# EAGLE schematic first_board5 (EAGLE 7.2.0)

## Sheet 1 of 2: MAIN
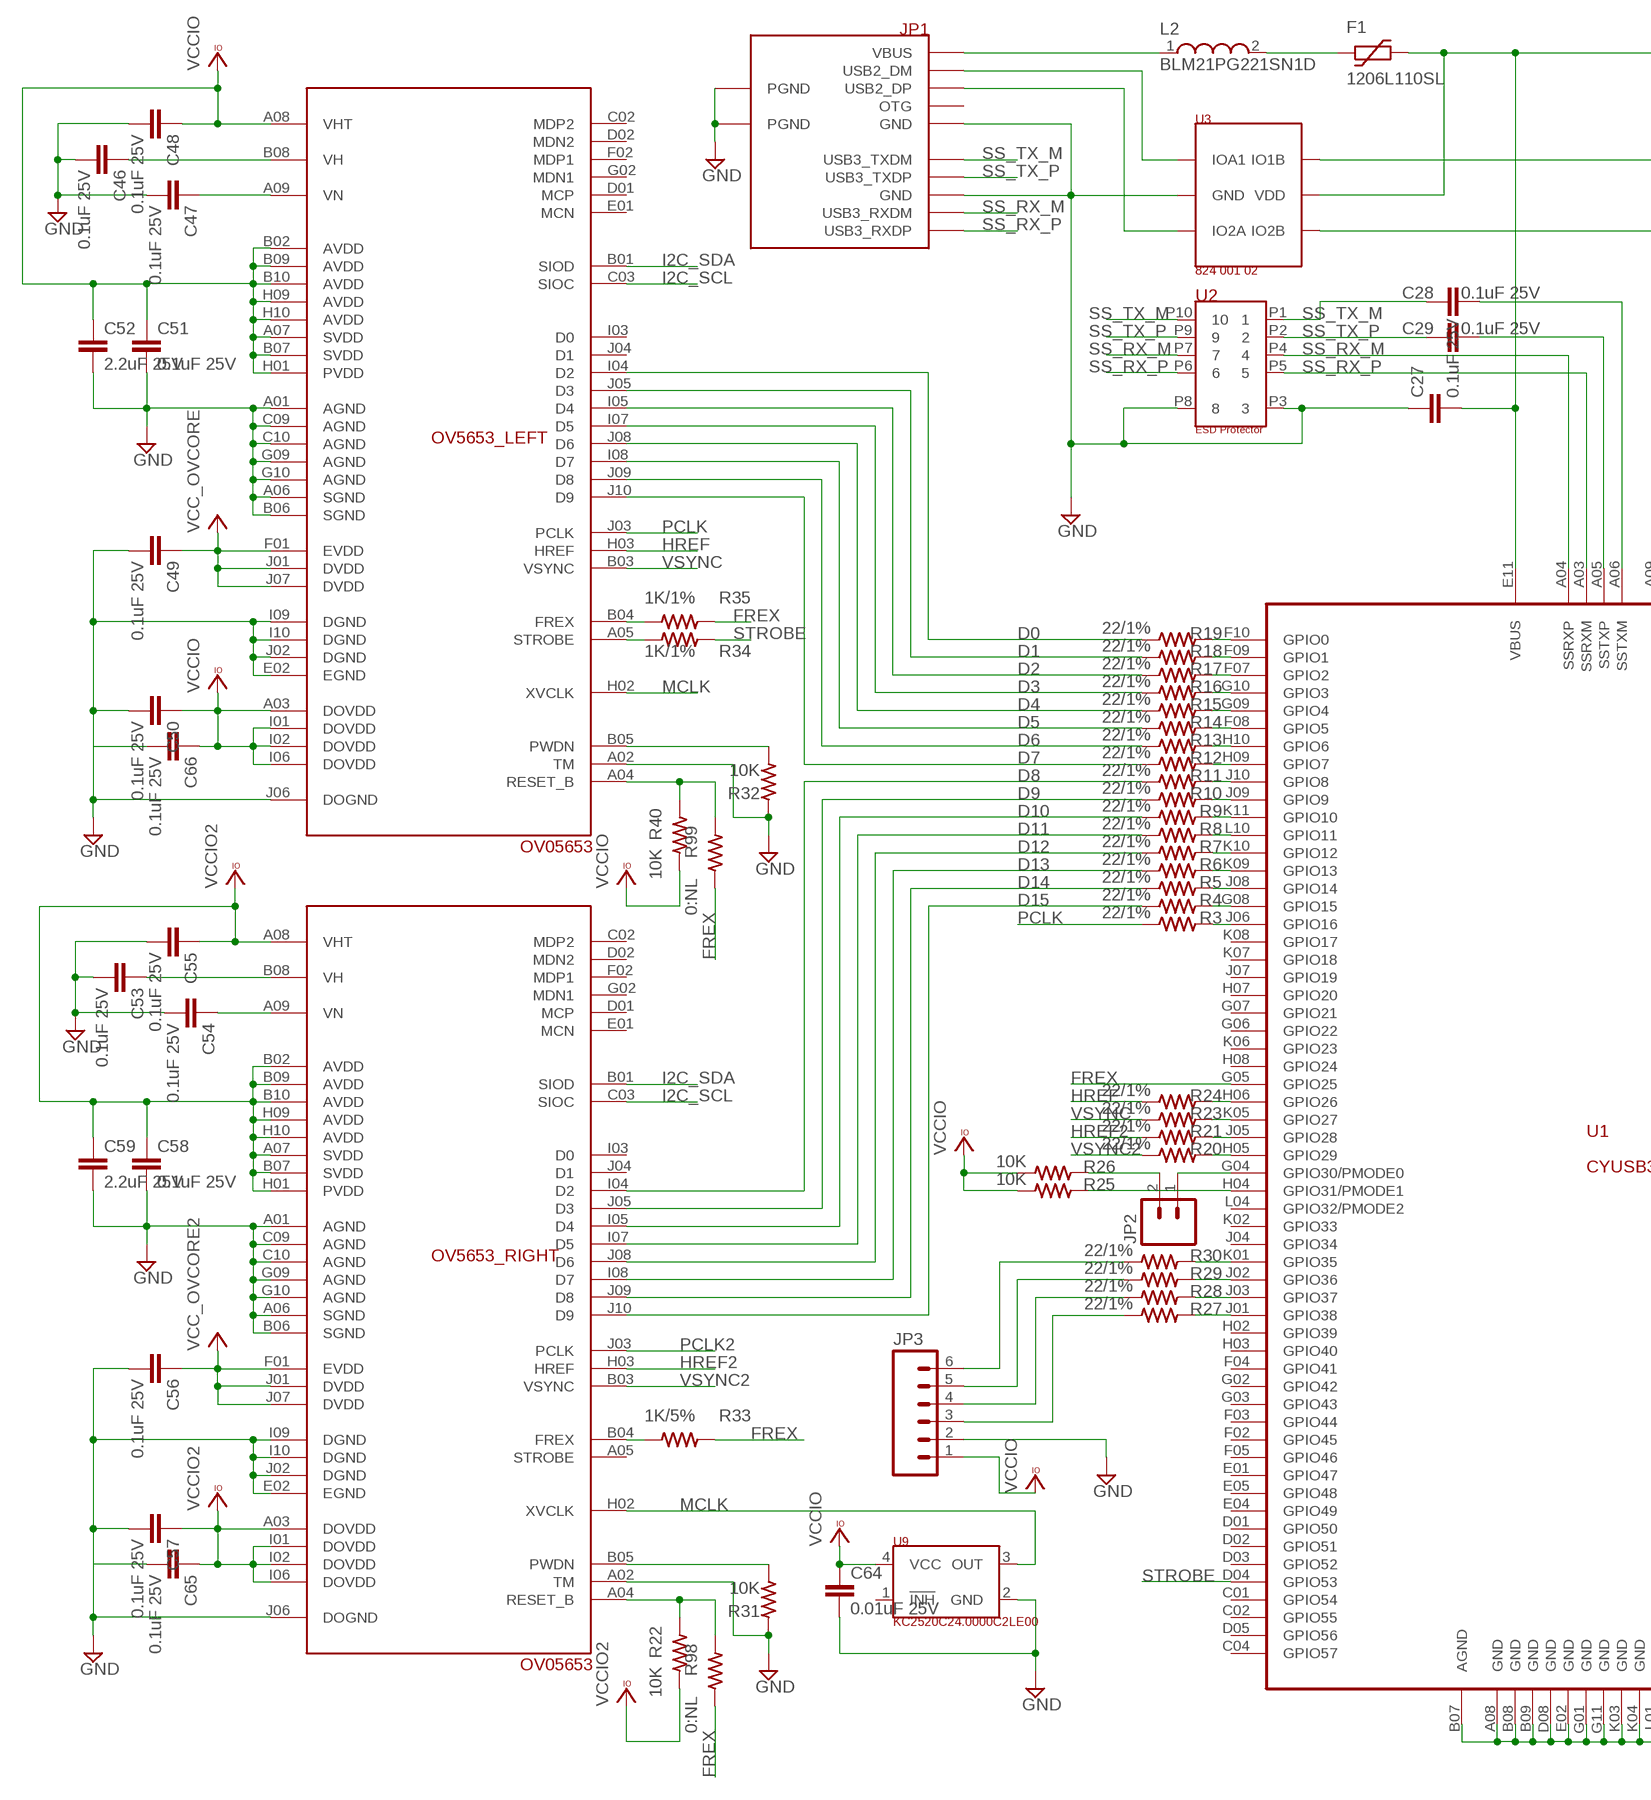
[diagram p0: schematic, sheet 1, part 1 of 2]
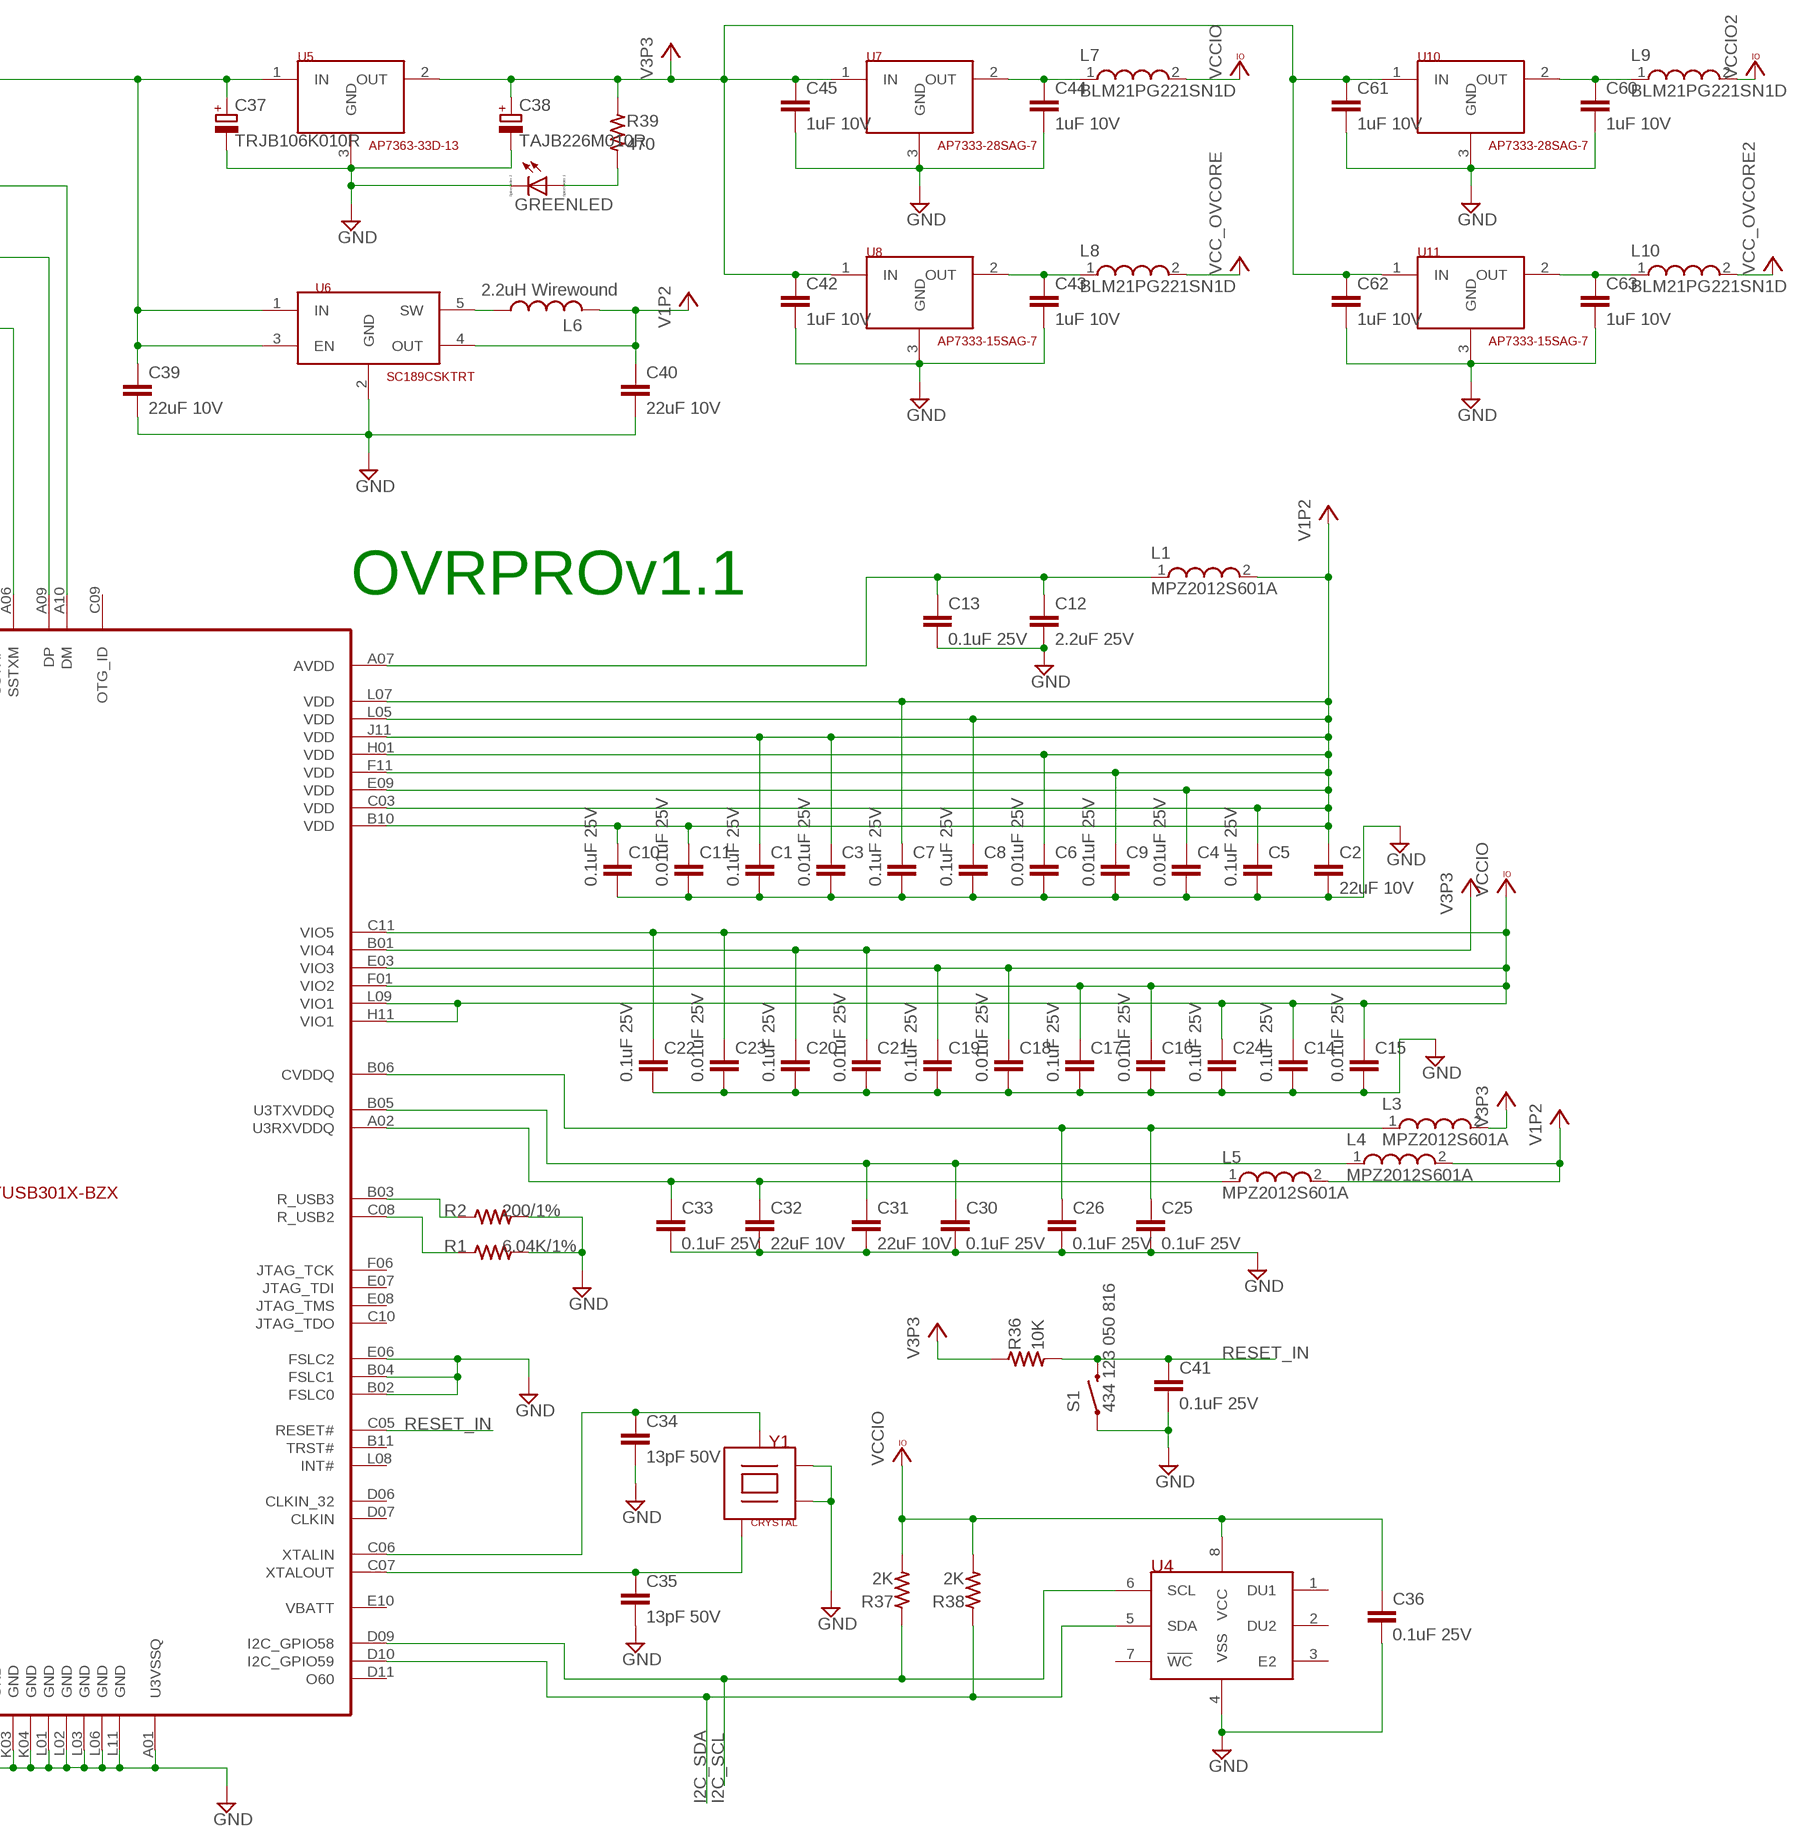
[diagram p1: schematic, sheet 1, part 2 of 2]

### Parts
C1  0.1uF 25V  C-EUC0402K  [C0402K]
C2  22uF 10V  C-EUC1206  [C1206]
C3  0.01uF 25V  C-EUC0402K  [C0402K]
C4  0.01uF 25V  C-EUC0402K  [C0402K]
C5  0.1uF 25V  C-EUC0402K  [C0402K]
C6  0.01uF 25V  C-EUC0402K  [C0402K]
C7  0.1uF 25V  C-EUC0402K  [C0402K]
C8  0.1uF 25V  C-EUC0402K  [C0402K]
C9  0.01uF 25V  C-EUC0402K  [C0402K]
C10  0.1uF 25V  C-EUC0402K  [C0402K]
C11  0.01uF 25V  C-EUC0402K  [C0402K]
C12  2.2uF 25V  C-EUC0805  [C0805]
C13  0.1uF 25V  C-EUC0402K  [C0402K]
C14  0.1uF 25V  C-EUC0402K  [C0402K]
C15  0.01uF 25V  C-EUC0402K  [C0402K]
C16  0.01uF 25V  C-EUC0402K  [C0402K]
C17  0.1uF 25V  C-EUC0402K  [C0402K]
C18  0.01uF 25V  C-EUC0402K  [C0402K]
C19  0.1uF 25V  C-EUC0402K  [C0402K]
C20  0.1uF 25V  C-EUC0402K  [C0402K]
C21  0.01uF 25V  C-EUC0402K  [C0402K]
C22  0.1uF 25V  C-EUC0402K  [C0402K]
C23  0.01uF 25V  C-EUC0402K  [C0402K]
C24  0.1uF 25V  C-EUC0402  [C0402]
C25  0.1uF 25V  C-EUC0402K  [C0402K]
C26  0.1uF 25V  C-EUC0402K  [C0402K]
C27  0.1uF 25V  C-EUC0402K  [C0402K]
C28  0.1uF 25V  C-EUC0402K  [C0402K]
C29  0.1uF 25V  C-EUC0402K  [C0402K]
C30  0.1uF 25V  C-EUC0402K  [C0402K]
C31  22uF 10V  C-EUC1206  [C1206]
C32  22uF 10V  C-EUC1206  [C1206]
C33  0.1uF 25V  C-EUC0402K  [C0402K]
C34  13pF 50V  C-EUC0402K  [C0402K]
C35  13pF 50V  C-EUC0402K  [C0402K]
C36  0.1uF 25V  C-EUC0402  [C0402]
C37  TRJB106K010R  CPOL-EUCT3528  [CT3528]
C38  TAJB226M010R  CPOL-EUCT3528  [CT3528]
C39  22uF 10V  C-EUC1206  [C1206]
C40  22uF 10V  C-EUC1206  [C1206]
C41  0.1uF 25V  C-EUC0402  [C0402]
C42  1uF 10V  C-EUC0402  [C0402]
C43  1uF 10V  C-EUC0402  [C0402]
C44  1uF 10V  C-EUC0402  [C0402]
C45  1uF 10V  C-EUC0402  [C0402]
C46  0.1uF 25V  C-EUC0402K  [C0402K]
C47  0.1uF 25V  C-EUC0402K  [C0402K]
C48  0.1uF 25V  C-EUC0402K  [C0402K]
C49  0.1uF 25V  C-EUC0402K  [C0402K]
C50  0.1uF 25V  C-EUC0402K  [C0402K]
C51  0.1uF 25V  C-EUC0402K  [C0402K]
C52  2.2uF 25V  C-EUC0805  [C0805]
C53  0.1uF 25V  C-EUC0402K  [C0402K]
C54  0.1uF 25V  C-EUC0402K  [C0402K]
C55  0.1uF 25V  C-EUC0402K  [C0402K]
C56  0.1uF 25V  C-EUC0402K  [C0402K]
C57  0.1uF 25V  C-EUC0402K  [C0402K]
C58  0.1uF 25V  C-EUC0402K  [C0402K]
C59  2.2uF 25V  C-EUC0805  [C0805]
C60  1uF 10V  C-EUC0402  [C0402]
C61  1uF 10V  C-EUC0402  [C0402]
C62  1uF 10V  C-EUC0402  [C0402]
C63  1uF 10V  C-EUC0402  [C0402]
C64  0.01uF 25V  C-EUC0402K  [C0402K]
C65  0.1uF 25V  C-EUC0402K  [C0402K]
C66  0.1uF 25V  C-EUC0402K  [C0402K]
F1  1206L110SL  1206L  [1206L]
GREENLED  LED_ESML0603  [LED_SML0603]
JP1  ZX360D-B-10PUSB3  [ZX360D-B-10PUSB3]
JP2  M02PTH  [1X02]
JP3  M06SILK_FEMALE_PTH  [1X06]
L1  MPZ2012S601A  WE-CBA_0805(WB/HS)  [WE-CBA_0805(W=3)]
L2  BLM21PG221SN1D  WE-CBA_0805(WB/HS)  [WE-CBA_0805(W=3)]
L3  MPZ2012S601A  WE-CBA_0805(WB/HS)  [WE-CBA_0805(W=3)]
L4  MPZ2012S601A  WE-CBA_0805(WB/HS)  [WE-CBA_0805(W=3)]
L5  MPZ2012S601A  WE-CBA_0805(WB/HS)  [WE-CBA_0805(W=3)]
L6  2.2uH Wirewound  L-USL3225M  [L3225M]
L7  BLM21PG221SN1D  WE-CBA_0805(WB/HS)  [WE-CBA_0805(W=3)]
L8  BLM21PG221SN1D  WE-CBA_0805(WB/HS)  [WE-CBA_0805(W=3)]
L9  BLM21PG221SN1D  WE-CBA_0805(WB/HS)  [WE-CBA_0805(W=3)]
L10  BLM21PG221SN1D  WE-CBA_0805(WB/HS)  [WE-CBA_0805(W=3)]
OV5653_LEFT  OV05653-A66A  [OV05653-A66A]
OV5653_RIGHT  OV05653-A66A  [OV05653-A66A]
R1  6.04K/1%  RESISTOR-US1608  [SMD1608]
R2  200/1%  RESISTOR-US1608  [SMD1608]
R3  22/1%  RESISTOR-US1005  [SMD1005]
R4  22/1%  RESISTOR-US1005  [SMD1005]
R5  22/1%  RESISTOR-US1005  [SMD1005]
R6  22/1%  RESISTOR-US1005  [SMD1005]
R7  22/1%  RESISTOR-US1005  [SMD1005]
R8  22/1%  RESISTOR-US1005  [SMD1005]
R9  22/1%  RESISTOR-US1005  [SMD1005]
R10  22/1%  RESISTOR-US1005  [SMD1005]
R11  22/1%  RESISTOR-US1005  [SMD1005]
R12  22/1%  RESISTOR-US1005  [SMD1005]
R13  22/1%  RESISTOR-US1005  [SMD1005]
R14  22/1%  RESISTOR-US1005  [SMD1005]
R15  22/1%  RESISTOR-US1005  [SMD1005]
R16  22/1%  RESISTOR-US1005  [SMD1005]
R17  22/1%  RESISTOR-US1005  [SMD1005]
R18  22/1%  RESISTOR-US1005  [SMD1005]
R19  22/1%  RESISTOR-US1005  [SMD1005]
R20  22/1%  RESISTOR-US1005  [SMD1005]
R21  22/1%  RESISTOR-US1005  [SMD1005]
R22  10K  RESISTOR-US1608  [SMD1608]
R23  22/1%  RESISTOR-US1005  [SMD1005]
R24  22/1%  RESISTOR-US1005  [SMD1005]
R25  10K  RESISTOR-US1608  [SMD1608]
R26  10K  RESISTOR-US1608  [SMD1608]
R27  22/1%  RESISTOR-US1005  [SMD1005]
R28  22/1%  RESISTOR-US1005  [SMD1005]
R29  22/1%  RESISTOR-US1005  [SMD1005]
R30  22/1%  RESISTOR-US1005  [SMD1005]
R31  10K  RESISTOR-US1608  [SMD1608]
R32  10K  RESISTOR-US1608  [SMD1608]
R33  1K/5%  RESISTOR-US1005  [SMD1005]
R34  1K/1%  RESISTOR-US1005  [SMD1005]
R35  1K/1%  RESISTOR-US1005  [SMD1005]
R36  10K  RESISTOR-US1608  [SMD1608]
R37  2K  RESISTOR-US1608  [SMD1608]
R38  2K  RESISTOR-US1608  [SMD1608]
R39  470  RESISTOR-US1608  [SMD1608]
R40  10K  RESISTOR-US1608  [SMD1608]
R98  0:NL  RESISTOR-US1005  [SMD1005]
R99  0:NL  RESISTOR-US1005  [SMD1005]
S1  434 123 050 816  SWITCH-MOMENTARY-2SMD-1101NE  [TACTILE-SWITCH-1101NE]
U1  CYUSB301X-BZX  [BGA121]
U2  SP3010-04UTG  [SP3010-04UTG]
U3  WE-82400102  [WE-82400102]
U4  M24M02-DRMN6TP  [SO-08]
U5  AP7363-33D-13  AP7363-XXD-13  [TO-252]
U6  SC189CSKTRT  PAM2305AABXXX  [SOT23-5]
U7  AP7333-28SAG-7  AP7333-XXSAG-7  [SOT23]
U8  AP7333-15SAG-7  AP7333-XXSAG-7  [SOT23]
U9  KC2520C24.0000C2LE00  KC2520C-C2  [KC2520C-C2]
U10  AP7333-28SAG-7  AP7333-XXSAG-7  [SOT23]
U11  AP7333-15SAG-7  AP7333-XXSAG-7  [SOT23]
Y1  NX2520SACRY  [NX2520SACRY]

### Nets
312: R15.2 U1.G09(GPIO4)
321: R16.2 U1.G10(GPIO3)
+3V3: C20.1 C21.1 C38.+ C42.1 C45.1 C61.1 C62.1 L3.2 R36.1 R39.1 U1.B01(VIO4) U5.2(OUT) U7.1(IN) U8.1(IN) U10.1(IN) U11.1(IN) ; supply symbol labelled V3P3
+5V: C1.1 C2.1 C3.1 C4.1 C5.1 C6.1 C7.1 C8.1 C9.1 C10.1 C11.1 C40.1 L1.2 L4.2 L5.2 L6.2 U1.B10(VDD) U1.C03(VDD) U1.E09(VDD) U1.F11(VDD) U1.H01(VDD) U1.J11(VDD) U1.L05(VDD) U1.L07(VDD) U6.4(OUT) ; supply symbol labelled V1P2
D0: OV5653_LEFT.I04(D2) R19.1
D1: OV5653_LEFT.J05(D3) R18.1
D2: OV5653_LEFT.I05(D4) R17.1
D3: OV5653_LEFT.I07(D5) R16.1
D4: OV5653_LEFT.J08(D6) R15.1
D5: OV5653_LEFT.I08(D7) R14.1
D6: OV5653_LEFT.J09(D8) R13.1
D7: OV5653_LEFT.J10(D9) R12.1
D8: OV5653_RIGHT.I04(D2) R11.1
D9: OV5653_RIGHT.J05(D3) R10.1
D10: OV5653_RIGHT.I05(D4) R9.1
D11: OV5653_RIGHT.I07(D5) R8.1
D12: OV5653_RIGHT.J08(D6) R7.1
D13: OV5653_RIGHT.I08(D7) R6.1
D14: OV5653_RIGHT.J09(D8) R5.1
D15: OV5653_RIGHT.J10(D9) R4.1
FREX: R33.2 R35.2 R98.1 R99.1 U1.G05(GPIO25)
GND: C1.2 C2.2 C3.2 C4.2 C5.2 C6.2 C7.2 C8.2 C9.2 C10.2 C11.2 C12.2 C13.2 C14.2 C15.2 C16.2 C17.2 C18.2 C19.2 C20.2 C21.2 C22.2 C23.2 C24.2 C25.2 C26.2 C27.1 C30.2 C31.2 C32.2 C33.2 C34.2 C35.2 C36.2 C37.- C38.- C39.2 C40.2 C41.2 C42.2 C43.2 C44.2 C45.2 C46.2 C47.2 C48.2 C49.2 C50.2 C51.2 C52.2 C53.2 C54.2 C55.2 C56.2 C57.2 C58.2 C59.2 C60.2 C61.2 C62.2 C63.2 C64.2 C65.2 C66.2 GREENLED.C JP1.GND@1(GND) JP1.GND@2(GND) JP1.PGND@1(PGND) JP1.PGND@2(PGND) JP3.2 OV5653_LEFT.A01(AGND) OV5653_LEFT.A02(TM) OV5653_LEFT.A06(SGND) OV5653_LEFT.B06(SGND) OV5653_LEFT.C09(AGND) OV5653_LEFT.C10(AGND) OV5653_LEFT.E02(EGND) OV5653_LEFT.G09(AGND) OV5653_LEFT.G10(AGND) OV5653_LEFT.I09(DGND) OV5653_LEFT.I10(DGND) OV5653_LEFT.J02(DGND) OV5653_LEFT.J06(DOGND) OV5653_RIGHT.A01(AGND) OV5653_RIGHT.A02(TM) OV5653_RIGHT.A06(SGND) OV5653_RIGHT.B06(SGND) OV5653_RIGHT.C09(AGND) OV5653_RIGHT.C10(AGND) OV5653_RIGHT.E02(EGND) OV5653_RIGHT.G09(AGND) OV5653_RIGHT.G10(AGND) OV5653_RIGHT.I09(DGND) OV5653_RIGHT.I10(DGND) OV5653_RIGHT.J02(DGND) OV5653_RIGHT.J06(DOGND) R1.2 R2.2 R31.1 R32.1 S1.1 U1.A01(U3VSSQ) U1.A08(GND) U1.B02(FSLC0) U1.B04(FSLC1) U1.B07(AGND) U1.B08(GND) U1.B09(GND) U1.D08(GND) U1.E02(GND) U1.E06(FSLC2) U1.G01(GND) U1.G11(GND) U1.K03(GND) U1.K04(GND) U1.L01(GND) U1.L02(GND) U1.L03(GND) U1.L06(GND) U1.L11(GND) U2.P3 U2.P8 U3.P2(GND) U4.4(VSS) U5.3(GND) U6.2(GND) U7.3(GND) U8.3(GND) U9.2(GND) U10.3(GND) U11.3(GND) Y1.P2 Y1.P4
HREF: OV5653_LEFT.H03(HREF) R24.1
HREF2: OV5653_RIGHT.H03(HREF) R21.1
I2C_SCL: OV5653_LEFT.C03(SIOC) OV5653_RIGHT.C03(SIOC) R37.1 U1.D09(I2C_GPIO58) U4.6(SCL)
I2C_SDA: OV5653_LEFT.B01(SIOD) OV5653_RIGHT.B01(SIOD) R38.1 U1.D10(I2C_GPIO59) U4.5(SDA)
MCLK: OV5653_LEFT.H02(XVCLK) OV5653_RIGHT.H02(XVCLK) U9.3(OUT)
N$1: R2.1 U1.B03(R_USB3)
N$2: C12.1 C13.1 L1.1 U1.A07(AVDD)
N$4: R1.1 U1.C08(R_USB2)
N$26: JP2.2 R26.2
N$27: R25.2 U1.H04(GPIO31/PMODE1)
N$29: C25.1 C26.1 L3.1 U1.B06(CVDDQ)
N$30: L6.1 U6.5(SW)
N$31: F1.P$1 L2.2
N$32: C44.1 L7.1 U7.2(OUT)
N$33: JP1.USB2_DM U3.P1(IOA1)
N$34: JP1.USB2_DP U3.P3(IO2A)
N$35: C32.1 C33.1 L5.1 U1.A02(U3RXVDDQ)
N$36: U1.A10(DM) U3.P6(IO1B)
N$37: U1.A09(DP) U3.P4(IO2B)
N$38: C30.1 C31.1 L4.1 U1.B05(U3TXVDDQ)
N$39: C34.1 U1.C06(XTALIN) Y1.P1
N$40: C35.1 U1.C07(XTALOUT) Y1.P3
N$41: GREENLED.A R39.2
N$43: C47.1 OV5653_LEFT.A09(VN)
N$45: C46.1 OV5653_LEFT.B08(VH)
N$46: C28.2 U1.A06(SSTXM)
N$47: C29.2 U1.A05(SSTXP)
N$48: OV5653_RIGHT.B05(PWDN) R31.2
N$49: JP3.6 R30.1
N$50: OV5653_LEFT.B05(PWDN) R32.2
N$51: JP3.5 R29.1
N$52: JP3.4 R28.1
N$53: JP3.3 R27.1
N$54: R30.2 U1.K01(GPIO35)
N$55: R29.2 U1.J02(GPIO36)
N$56: R28.2 U1.J03(GPIO37)
N$57: R27.2 U1.J01(GPIO38)
N$60: C27.2 C37.+ C39.1 F1.P$2 U1.E11(VBUS) U3.P5(VDD) U5.1(IN) U6.1(IN) U6.3(EN)
N$61: JP1.VBUS L2.1
N$62: C43.1 L8.1 U8.2(OUT)
N$63: C60.1 L9.1 U10.2(OUT)
N$64: C63.1 L10.1 U11.2(OUT)
N$65: JP2.1 U1.G04(GPIO30/PMODE0)
N$84: OV5653_RIGHT.B04(FREX) R33.1
N$86: OV5653_LEFT.A05(STROBE) R34.1
N$87: R3.2 U1.J06(GPIO16)
N$88: R11.2 U1.J10(GPIO8)
N$89: R10.2 U1.J09(GPIO9)
N$90: R9.2 U1.K11(GPIO10)
N$91: R8.2 U1.L10(GPIO11)
N$92: R7.2 U1.K10(GPIO12)
N$93: R6.2 U1.K09(GPIO13)
N$94: R5.2 U1.J08(GPIO14)
N$95: R4.2 U1.G08(GPIO15)
N$96: R21.2 U1.J05(GPIO28)
N$97: R20.2 U1.H05(GPIO29)
N$98: OV5653_LEFT.B04(FREX) R35.1
N$99: R24.2 U1.H06(GPIO26)
N$100: R23.2 U1.K05(GPIO27)
N$101: R14.2 U1.F08(GPIO5)
N$102: R13.2 U1.H10(GPIO6)
N$103: R12.2 U1.H09(GPIO7)
N$106: R17.2 U1.F07(GPIO2)
N$107: R18.2 U1.F09(GPIO1)
N$108: R19.2 U1.F10(GPIO0)
OV_RESET1: OV5653_LEFT.A04(RESET_B) R40.2 R99.2
OV_RESET2: OV5653_RIGHT.A04(RESET_B) R22.2 R98.2
PCLK: OV5653_LEFT.J03(PCLK) R3.1
PCLK2: OV5653_RIGHT.J03(PCLK)
RESET_IN: C41.1 R36.2 S1.2 U1.C05(RESET#)
SS_RX_M: JP1.USB3_RXDM U1.A04(SSRXP) U2.P4 U2.P7
SS_RX_P: JP1.USB3_RXDP U1.A03(SSRXM) U2.P5 U2.P6
SS_TX_M: C28.1 JP1.USB3_TXDM U2.P1 U2.P10
SS_TX_P: C29.1 JP1.USB3_TXDP U2.P2 U2.P9
STROBE: R34.2 U1.D04(GPIO53)
VCC: C49.1 L8.2 OV5653_LEFT.F01(EVDD) OV5653_LEFT.J01(DVDD) OV5653_LEFT.J07(DVDD) ; supply symbol labelled VCC_OVCORE
VCC2: C56.1 L10.2 OV5653_RIGHT.F01(EVDD) OV5653_RIGHT.J01(DVDD) OV5653_RIGHT.J07(DVDD) ; supply symbol labelled VCC_OVCORE2
VCCIO: C14.1 C15.1 C16.1 C17.1 C18.1 C19.1 C22.1 C23.1 C24.1 C36.1 C48.1 C50.1 C51.1 C52.1 C55.1 C57.1 C58.1 C59.1 C64.1 C65.1 C66.1 JP3.1 L7.2 L9.2 OV5653_LEFT.A03(DOVDD) OV5653_LEFT.A07(SVDD) OV5653_LEFT.A08(VHT) OV5653_LEFT.B02(AVDD) OV5653_LEFT.B07(SVDD) OV5653_LEFT.B09(AVDD) OV5653_LEFT.B10(AVDD) OV5653_LEFT.H01(PVDD) OV5653_LEFT.H09(AVDD) OV5653_LEFT.H10(AVDD) OV5653_LEFT.I01(DOVDD) OV5653_LEFT.I02(DOVDD) OV5653_LEFT.I06(DOVDD) OV5653_RIGHT.A03(DOVDD) OV5653_RIGHT.A07(SVDD) OV5653_RIGHT.A08(VHT) OV5653_RIGHT.B02(AVDD) OV5653_RIGHT.B07(SVDD) OV5653_RIGHT.B09(AVDD) OV5653_RIGHT.B10(AVDD) OV5653_RIGHT.H01(PVDD) OV5653_RIGHT.H09(AVDD) OV5653_RIGHT.H10(AVDD) OV5653_RIGHT.I01(DOVDD) OV5653_RIGHT.I02(DOVDD) OV5653_RIGHT.I06(DOVDD) R22.1 R25.1 R26.1 R37.2 R38.2 R40.1 U1.C11(VIO5) U1.E03(VIO3) U1.F01(VIO2) U1.H11(VIO1) U1.L09(VIO1) U4.8(VCC) U9.4(VCC) ; supply symbol labelled VCCIO2
VH: C53.1 OV5653_RIGHT.B08(VH)
VN: C54.1 OV5653_RIGHT.A09(VN)
VSYNC: OV5653_LEFT.B03(VSYNC) R23.1
VSYNC2: OV5653_RIGHT.B03(VSYNC) R20.1
Unconnected: JP1.USBOTG(OTG) OV5653_LEFT.C02(MDP2) OV5653_LEFT.D01(MCP) OV5653_LEFT.D02(MDN2) OV5653_LEFT.E01(MCN) OV5653_LEFT.F02(MDP1) OV5653_LEFT.G02(MDN1) OV5653_LEFT.I03(D0) OV5653_LEFT.J04(D1) OV5653_RIGHT.A05(STROBE) OV5653_RIGHT.C02(MDP2) OV5653_RIGHT.D01(MCP) OV5653_RIGHT.D02(MDN2) OV5653_RIGHT.E01(MCN) OV5653_RIGHT.F02(MDP1) OV5653_RIGHT.G02(MDN1) OV5653_RIGHT.I03(D0) OV5653_RIGHT.J04(D1) U1.B11(TRST#) U1.C01(GPIO54) U1.C02(GPIO55) U1.C04(GPIO57) U1.C09(OTG_ID) U1.C10(JTAG_TDO) U1.D01(GPIO50) U1.D02(GPIO51) U1.D03(GPIO52) U1.D05(GPIO56) U1.D06(CLKIN_32) U1.D07(CLKIN) U1.D11(O60) U1.E01(GPIO47) U1.E04(GPIO49) U1.E05(GPIO48) U1.E07(JTAG_TDI) U1.E08(JTAG_TMS) U1.E10(VBATT) U1.F02(GPIO45) U1.F03(GPIO44) U1.F04(GPIO41) U1.F05(GPIO46) U1.F06(JTAG_TCK) U1.G02(GPIO42) U1.G03(GPIO43) U1.G06(GPIO22) U1.G07(GPIO21) U1.H02(GPIO39) U1.H03(GPIO40) U1.H07(GPIO20) U1.H08(GPIO24) U1.J04(GPIO34) U1.J07(GPIO19) U1.K02(GPIO33) U1.K06(GPIO23) U1.K07(GPIO18) U1.K08(GPIO17) U1.L04(GPIO32/PMODE2) U1.L08(INT#) U4.1(DU1) U4.2(DU2) U4.3(E2) U4.7(!WC) U9.1(!INH)

### Notes on the sheet
- OVRPROv1.1

## Sheet 2 of 2

## Library data of the parts
C1-C36 C39-C66 = rcl:C-EU: CAPACITOR, European symbol
C37 C38 = rcl:CPOL-EU: POLARIZED CAPACITOR, European symbol
F1 = wizapplyParts:1206L
GREENLED = eagle-ltspice:LED_E: LED Source: http://www.osram.convergy.de Source: www.luxeon.com Source: www.kingbright.com; SPICEMODEL: NONE; SPICEPREFIX: D; SPICETYPE: diode
JP1 = wizapplyParts:ZX360D-B-10PUSB3
JP2 = SparkFun-Connectors:M02: Standard 2-pin 0.1" header. Use with - straight break away headers ( PRT-00116) - right angle break away headers (PRT-00553) - swiss pins (PRT-00743) - machine pins (PRT-00117) - female headers (PRT-00115) Molex polarized connector foot print use with: PRT-08233 with associated crimp pins and housings. 2.54_SCREWTERM for use with PRT-10571. 3.5mm Screw Terminal footprints for PRT-08084 5mm Screw Terminal footprints for use with PRT-08432
JP3 = SparkFun-Connectors:M06: Header 6 Standard 6-pin 0.1" header. Use with straight break away headers (SKU : PRT-00116), right angle break away headers (PRT-00553), swiss pins (PRT-00743), machine pins (PRT-00117), and female headers (PRT-00115). Molex polarized connector foot print use with SKU : PRT-08094 with associated crimp pins and housings. NOTES ON THE VARIANTS LOCK and LOCK_LONGPADS... This footprint was designed to help hold the alignment of a through-hole component (i.e. 6-pin header) while soldering it into place. You may notice that each hole has been shifted either up or down by 0.005 of an inch from it's more standard position (which is a perfectly straight line). This slight alteration caused the pins (the squares in the middle) to touch the edges of the holes. Because they are alternating, it causes a "brace" to hold the component in place. 0.005 has proven to be the perfect amount of "off-center" position when using our standard breakaway headers. Although looks a little odd when you look at the bare footprint, once you have a header in there, the alteration is very hard to notice. Also,if you push a header all the way into place, it is covered up entirely on the bottom side. This idea of altering the position of holes to aid alignment will be further integrated into the Sparkfun Library for other footprints. It can help hold any component with 3 or more connection pins.; PROD_ID: CONN-08437
L1-L5 L7-L10 = EMCComponents:WE-CBA: WE-CBA SMD EMI Suppression Ferrite Bead Characteristics Reliable Ni-Sn electrodes High rated current up to 5A Recommended soldering: Reflow Operating temperature: -55°C to +125°C Applications * Perfect as data line filter and for uncoupling of distribution voltage *This special SMD chip bead ferrites can be put directly on the printed circuit board. They offer excellent anti-EMI properties and low DC-resistance. Placed very close next to the interference source even with smallest size 0402,maximal impedance at 1000 Ω can be reached. *High Speed: "High Speed " SMD ferrites WE-CBF have lower impedance in the lower frequency ranges thus they have only a low attenuation for fast signals. Application e.g. USB 2.0, IEEE 1394,LVDS *Wide Band: "Wide Band" SMD ferrites WE-CBF already show high impedance in low frequency range. Therefore they are wide band through the whole spectrum. Application e.g. control signats, RS232, RS422, DC/DC converter *High Current: "High Current " SMD ferrites WE-CBF are designed for high current (over 1 A). The rated current refers to 40K self-heating. High current SMD ferrites are available in all there types (High Speed, Wide Band and High Frequency). Application e.g. power supply, DC/DC converter *Advice: Pay attention for the use of SMD-Ferrites for high current>1A and ambient temperature over +85°C that the rated current has to be reduced when temperature is above +85°C (Derating). *At+100°C environment temperature the maximal rated current has to add up to only 60% of the data sheet value ,without an overload of the component. Variant abbreviation WB means WIDE BAND HS means HIGH SPEED HC means HIGH CURRENT <http://katalog.we-online.de/media/images/eisos/FeCBA_pf2.jpg> Details see: http://katalog.we-online.de/en/pbs/WE-CBA/ Created: 2015-02-02 2015 (C) Wurth Elektronik
L6 = rcl:L-US: INDUCTOR, American symbol
OV5653_LEFT OV5653_RIGHT = wizapplyParts:OV05653-A66A
R1-R40 R98 R99 = switchscience_generic:RESISTOR-US: Generic Registor
S1 = SparkFun-Electromechanical:SWITCH-MOMENTARY-2: Various NO switches- pushbuttons, reed, etc; PROD_ID: SWCH-00815
U1 = wizapplyParts:CYUSB301X-BZX
U2 = wizapplyParts:SP3010-04UTG: Datasheet http://www.littelfuse.com/~/media/electronics/datasheets/tvs_diode_arrays/littelfuse_tvs_diode_array_sp3010_datasheet.pdf.pdf
U3 = wizapplyParts:WE-82400102: Datasheet http://katalog.we-online.de/pbs/datasheet/82400152.pdf
U4 = wizapplyParts:M24M02-DRMN6TP
U5 = wizapplyParts:AP7363-XXD-13: DATASHEET http://www.diodes.com/datasheets/AP7363.pdf
U6 = wizapplyParts:PAM2305AABXXX: DATASHEET http://www.diodes.com/datasheets/PAM2305.pdf
U7 U8 U10 U11 = wizapplyParts:AP7333-XXSAG-7
U9 = wizapplyParts:KC2520C-C2
Y1 = wizapplyParts:NX2520SACRY: DATASHEET http://media.digikey.com/pdf/Data%20Sheets/NDK%20PDFs/NX2520SA-19.200000MHZ-NBG1.pdf